# EAGLE schematic MSV-back (EAGLE 9.5.2)

## Sheet 1 of 5
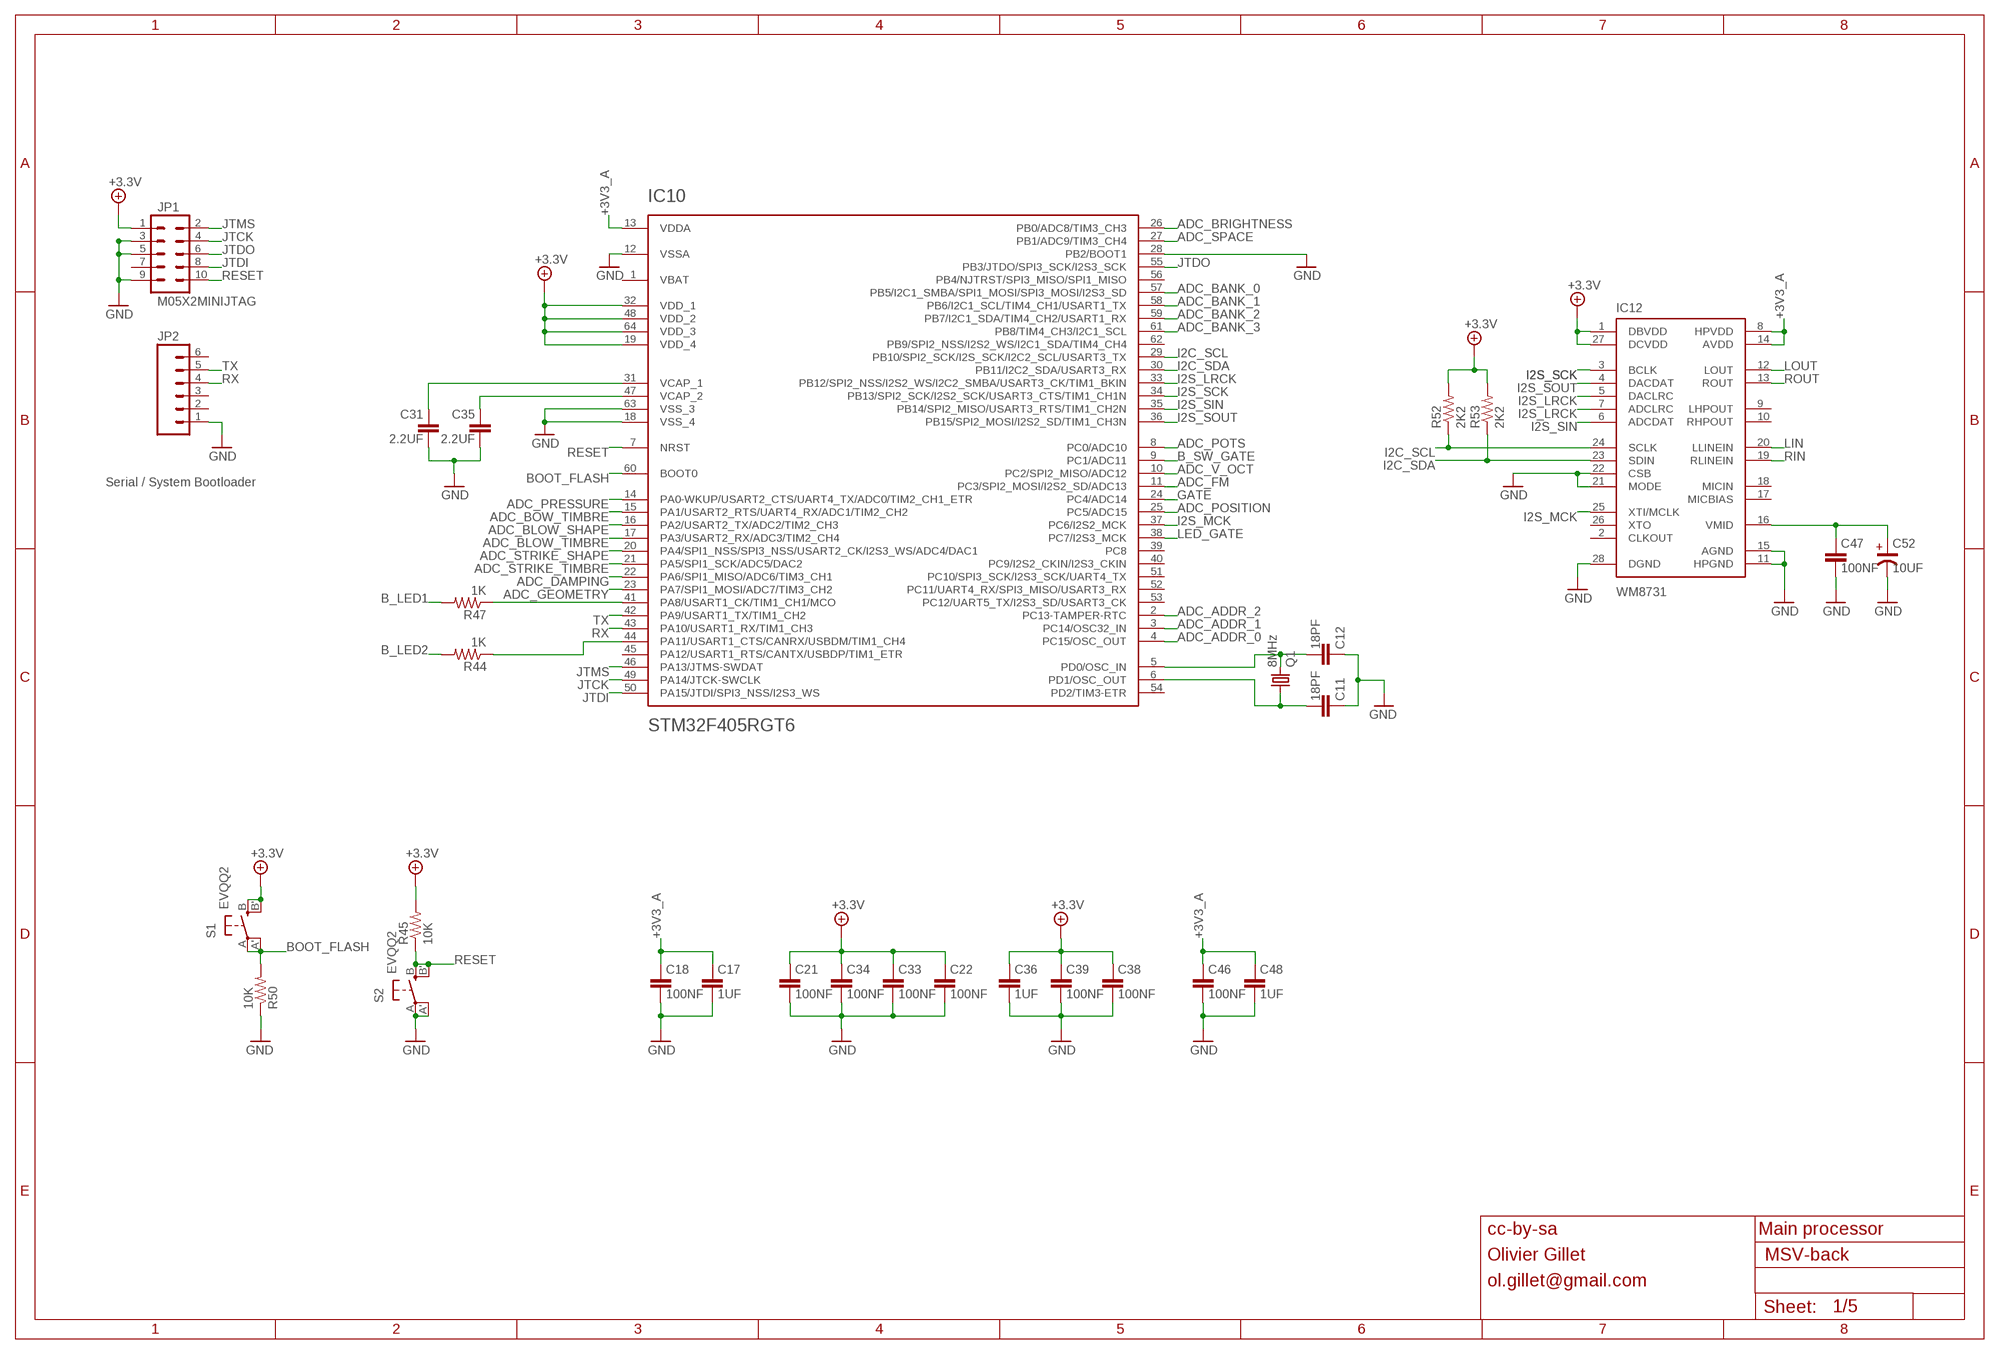
[diagram p0: schematic, sheet 1]

### Parts
C11  18PF  C-EUC0603  [C0603]
C12  18PF  C-EUC0603  [C0603]
C17  1UF  C-EUC0603  [C0603]
C18  100NF  C-EUC0603  [C0603]
C21  100NF  C-EUC0603  [C0603]
C22  100NF  C-EUC0603  [C0603]
C31  2.2UF  C-EUC0603  [C0603]
C33  100NF  C-EUC0603  [C0603]
C34  100NF  C-EUC0603  [C0603]
C35  2.2UF  C-EUC0603  [C0603]
C36  1UF  C-EUC0603  [C0603]
C38  100NF  C-EUC0603  [C0603]
C39  100NF  C-EUC0603  [C0603]
C46  100NF  C-EUC0603  [C0603]
C47  100NF  C-EUC0603  [C0603]
C48  1UF  C-EUC0603  [C0603]
C52  10UF  C-EU-POL_B  [PANASONIC_B]
IC10  STM32F405RGT6  STM32F20X  [TQFP-10X10-64]
IC12  WM8731  [SSOP-28]
JP1  M05X2MINIJTAG  [2X5-1.27]
JP2  M06_SQUARE  [1X06_SQUARE]
Q1  8MHz  CRYSTALHC49UP  [HC49UP]
R44  1K  R-US_R0603  [R0603]
R45  10K  R-US_R0603  [R0603]
R47  1K  R-US_R0603  [R0603]
R50  10K  R-US_R0603  [R0603]
R52  2K2  R-US_R0603  [R0603]
R53  2K2  R-US_R0603  [R0603]
S1  EVQQ2  [EVQ-Q2]
S2  EVQQ2  [EVQ-Q2]

### Nets
+3V3_A: C17.1 C18.1 C46.1 C48.1 IC10.13(VDDA) IC12.8(HPVDD) IC12.14(AVDD) ; also sheet 3,4,5
+3V3_D: C21.1 C22.1 C33.1 C34.1 C36.1 C38.1 C39.1 IC10.19(VDD_4) IC10.32(VDD_1) IC10.48(VDD_2) IC10.64(VDD_3) IC12.1(DBVDD) IC12.27(DCVDD) JP1.1 R45.2 R52.2 R53.2 S1.B'(S1) S1.B(S) ; supply symbol labelled +3.3V ; also sheet 5
ADC_ADDR_0: IC10.4(PC15/OSC_OUT) ; also sheet 4
ADC_ADDR_1: IC10.3(PC14/OSC32_IN) ; also sheet 4
ADC_ADDR_2: IC10.2(PC13-TAMPER-RTC) ; also sheet 4
ADC_BANK_0: IC10.57(PB5/I2C1_SMBA/SPI1_MOSI/SPI3_MOSI/I2S3_SD) ; also sheet 4
ADC_BANK_1: IC10.58(PB6/I2C1_SCL/TIM4_CH1/USART1_TX) ; also sheet 4
ADC_BANK_2: IC10.59(PB7/I2C1_SDA/TIM4_CH2/USART1_RX) ; also sheet 4
ADC_BANK_3: IC10.61(PB8/TIM4_CH3/I2C1_SCL) ; also sheet 4
ADC_BLOW_SHAPE: IC10.16(PA2/USART2_TX/ADC2/TIM2_CH3) ; also sheet 3
ADC_BLOW_TIMBRE: IC10.17(PA3/USART2_RX/ADC3/TIM2_CH4) ; also sheet 3
ADC_BOW_TIMBRE: IC10.15(PA1/USART2_RTS/UART4_RX/ADC1/TIM2_CH2) ; also sheet 3
ADC_BRIGHTNESS: IC10.26(PB0/ADC8/TIM3_CH3) ; also sheet 3
ADC_DAMPING: IC10.22(PA6/SPI1_MISO/ADC6/TIM3_CH1) ; also sheet 3
ADC_FM: IC10.11(PC3/SPI2_MOSI/I2S2_SD/ADC13) ; also sheet 3
ADC_GEOMETRY: IC10.23(PA7/SPI1_MOSI/ADC7/TIM3_CH2) ; also sheet 3
ADC_POSITION: IC10.25(PC5/ADC15) ; also sheet 3
ADC_POTS: IC10.8(PC0/ADC10) ; also sheet 4
ADC_PRESSURE: IC10.14(PA0-WKUP/USART2_CTS/UART4_TX/ADC0/TIM2_CH1_ETR) ; also sheet 3
ADC_SPACE: IC10.27(PB1/ADC9/TIM3_CH4) ; also sheet 3
ADC_STRIKE_SHAPE: IC10.20(PA4/SPI1_NSS/SPI3_NSS/USART2_CK/I2S3_WS/ADC4/DAC1) ; also sheet 3
ADC_STRIKE_TIMBRE: IC10.21(PA5/SPI1_SCK/ADC5/DAC2) ; also sheet 3
ADC_V_OCT: IC10.10(PC2/SPI2_MISO/ADC12) ; also sheet 3
B_LED1: R47.2 ; also sheet 4
B_LED2: R44.2 ; also sheet 4
B_SW_GATE: IC10.9(PC1/ADC11) ; also sheet 4
BOOT_FLASH: IC10.60(BOOT0) R50.2 S1.A'(P1) S1.A(P)
GATE: IC10.24(PC4/ADC14) ; also sheet 4
GND: C11.1 C12.1 C17.2 C18.2 C21.2 C22.2 C31.2 C33.2 C34.2 C35.2 C36.2 C38.2 C39.2 C46.2 C47.2 C48.2 C52.-(NEG) IC10.12(VSSA) IC10.18(VSS_4) IC10.28(PB2/BOOT1) IC10.63(VSS_3) IC12.11(HPGND) IC12.15(AGND) IC12.21(MODE) IC12.22(CSB) IC12.28(DGND) JP1.3 JP1.5 JP1.9 JP2.1 R50.1 S2.A'(P1) S2.A(P) ; also sheet 2,3,4,5
I2C_SCL: IC10.29(PB10/SPI2_SCK/I2S_SCK/I2C2_SCL/USART3_TX) IC12.24(SCLK) R52.1
I2C_SDA: IC10.30(PB11/I2C2_SDA/USART3_RX) IC12.23(SDIN) R53.1
I2S_LRCK: IC10.33(PB12/SPI2_NSS/I2S2_WS/I2C2_SMBA/USART3_CK/TIM1_BKIN) IC12.5(DACLRC) IC12.7(ADCLRC)
I2S_MCK: IC10.37(PC6/I2S2_MCK) IC12.25(XTI/MCLK)
I2S_SCK: IC10.34(PB13/SPI2_SCK/I2S2_SCK/USART3_CTS/TIM1_CH1N) IC12.3(BCLK)
I2S_SIN: IC10.35(PB14/SPI2_MISO/USART3_RTS/TIM1_CH2N) IC12.6(ADCDAT)
I2S_SOUT: IC10.36(PB15/SPI2_MOSI/I2S2_SD/TIM1_CH3N) IC12.4(DACDAT)
JTCK: IC10.49(PA14/JTCK-SWCLK) JP1.4
JTDI: IC10.50(PA15/JTDI/SPI3_NSS/I2S3_WS) JP1.8
JTDO: IC10.55(PB3/JTDO/SPI3_SCK/I2S3_SCK) JP1.6
JTMS: IC10.46(PA13/JTMS-SWDAT) JP1.2
LED_GATE: IC10.38(PC7/I2S3_MCK) ; also sheet 4
LIN: IC12.20(LLINEIN) ; also sheet 2
LOUT: IC12.12(LOUT) ; also sheet 2
N$7: C12.2 IC10.5(PD0/OSC_IN) Q1.2
N$8: C11.2 IC10.6(PD1/OSC_OUT) Q1.1
N$13: C35.1 IC10.47(VCAP_2)
N$17: C47.1 C52.+(POS) IC12.16(VMID)
N$19: C31.1 IC10.31(VCAP_1)
N$54: IC10.44(PA11/USART1_CTS/CANRX/USBDM/TIM1_CH4) R44.1
N$79: IC10.41(PA8/USART1_CK/TIM1_CH1/MCO) R47.1
RESET: IC10.7(NRST) JP1.10 R45.1 S2.B'(S1) S2.B(S)
RIN: IC12.19(RLINEIN) ; also sheet 2
ROUT: IC12.13(ROUT) ; also sheet 2
RX: IC10.43(PA10/USART1_RX/TIM1_CH3) JP2.4
TX: IC10.42(PA9/USART1_TX/TIM1_CH2) JP2.5
Unconnected: IC10.39(PC8) IC10.40(PC9/I2S2_CKIN/I2S3_CKIN) IC10.45(PA12/USART1_RTS/CANTX/USBDP/TIM1_ETR) IC10.51(PC10/SPI3_SCK/I2S3_SCK/UART4_TX) IC10.52(PC11/UART4_RX/SPI3_MISO/USART3_RX) IC10.53(PC12/UART5_TX/I2S3_SD/USART3_CK) IC10.54(PD2/TIM3-ETR) IC10.56(PB4/NJTRST/SPI3_MISO/SPI1_MISO) IC10.62(PB9/SPI2_NSS/I2S2_WS/I2C1_SDA/TIM4_CH4) IC12.2(CLKOUT) IC12.9(LHPOUT) IC12.10(RHPOUT) IC12.17(MICBIAS) IC12.18(MICIN) IC12.26(XTO) JP1.7 JP2.2 JP2.3 JP2.6

### Notes on the sheet
- Serial / System Bootloader
- cc-by-sa | Main processor
- Olivier Gillet
- ol.gillet@gmail.com

## Sheet 2 of 5
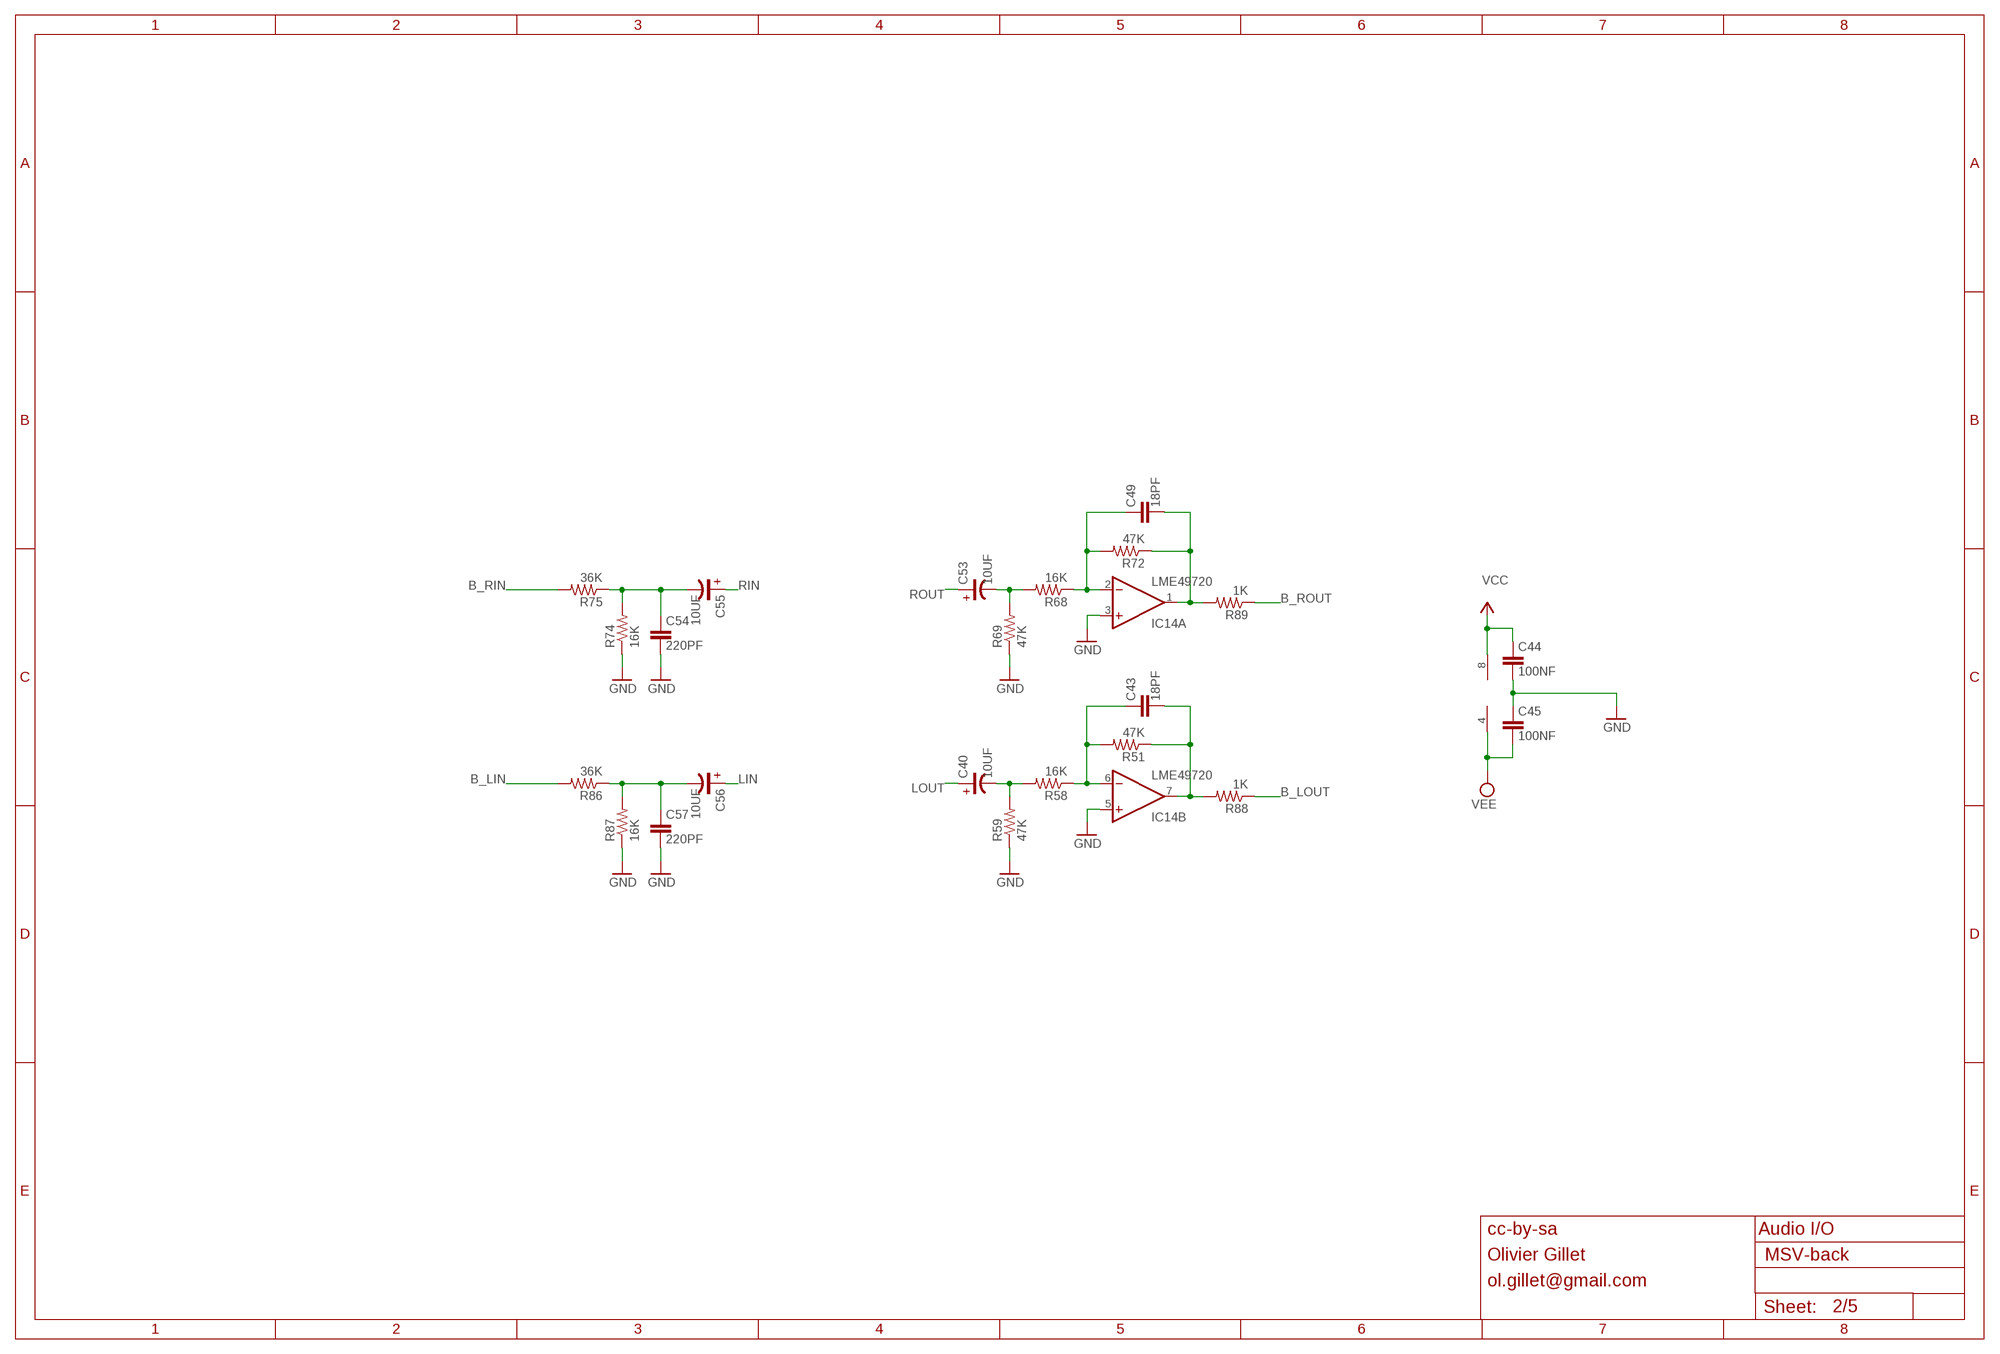
[diagram p1: schematic, sheet 2]

### Parts
C40  10UF  C-EU-POL_B  [PANASONIC_B]
C43  18PF  C-EUC0603  [C0603]
C44  100NF  C-EUC0603  [C0603]
C45  100NF  C-EUC0603  [C0603]
C49  18PF  C-EUC0603  [C0603]
C53  10UF  C-EU-POL_B  [PANASONIC_B]
C54  220PF  C-EUC0603  [C0603]
C55  10UF  C-EU-POL_B  [PANASONIC_B]
C56  10UF  C-EU-POL_B  [PANASONIC_B]
C57  220PF  C-EUC0603  [C0603]
IC14  LME49720  TL072_TSSOP-8  [TSSOP-8]
R51  47K  R-US_R0603  [R0603]
R58  16K  R-US_R0603  [R0603]
R59  47K  R-US_R0603  [R0603]
R68  16K  R-US_R0603  [R0603]
R69  47K  R-US_R0603  [R0603]
R72  47K  R-US_R0603  [R0603]
R74  16K  R-US_R0603  [R0603]
R75  36K  R-US_R0603  [R0603]
R86  36K  R-US_R0603  [R0603]
R87  16K  R-US_R0603  [R0603]
R88  1K  R-US_R0603  [R0603]
R89  1K  R-US_R0603  [R0603]

### Nets
B_LIN: R86.2 ; also sheet 4
B_LOUT: R88.1 ; also sheet 4
B_RIN: R75.2 ; also sheet 4
B_ROUT: R89.1 ; also sheet 4
GND: C44.2 C45.1 C54.2 C57.2 IC14.3(A:+IN) IC14.5(B:+IN) R59.1 R69.1 R74.1 R87.1 ; also sheet 1,3,4,5
LIN: C56.+(POS) ; also sheet 1
LOUT: C40.+(POS) ; also sheet 1
N$18: C56.-(NEG) C57.1 R86.1 R87.2
N$22: C54.1 C55.-(NEG) R74.2 R75.1
N$23: C40.-(NEG) R58.2 R59.2
N$25: C43.1 IC14.6(B:-IN) R51.2 R58.1
N$28: C43.2 IC14.7(B:OUT) R51.1 R88.2
N$31: C53.-(NEG) R68.2 R69.2
N$32: C49.1 IC14.2(A:-IN) R68.1 R72.2
N$33: C49.2 IC14.1(A:OUT) R72.1 R89.2
RIN: C55.+(POS) ; also sheet 1
ROUT: C53.+(POS) ; also sheet 1
VCC: C44.1 IC14.8(P:V+) ; also sheet 5
VEE: C45.2 IC14.4(P:V-) ; also sheet 5

### Notes on the sheet
- cc-by-sa | Audio I/O
- Olivier Gillet
- ol.gillet@gmail.com

## Sheet 3 of 5
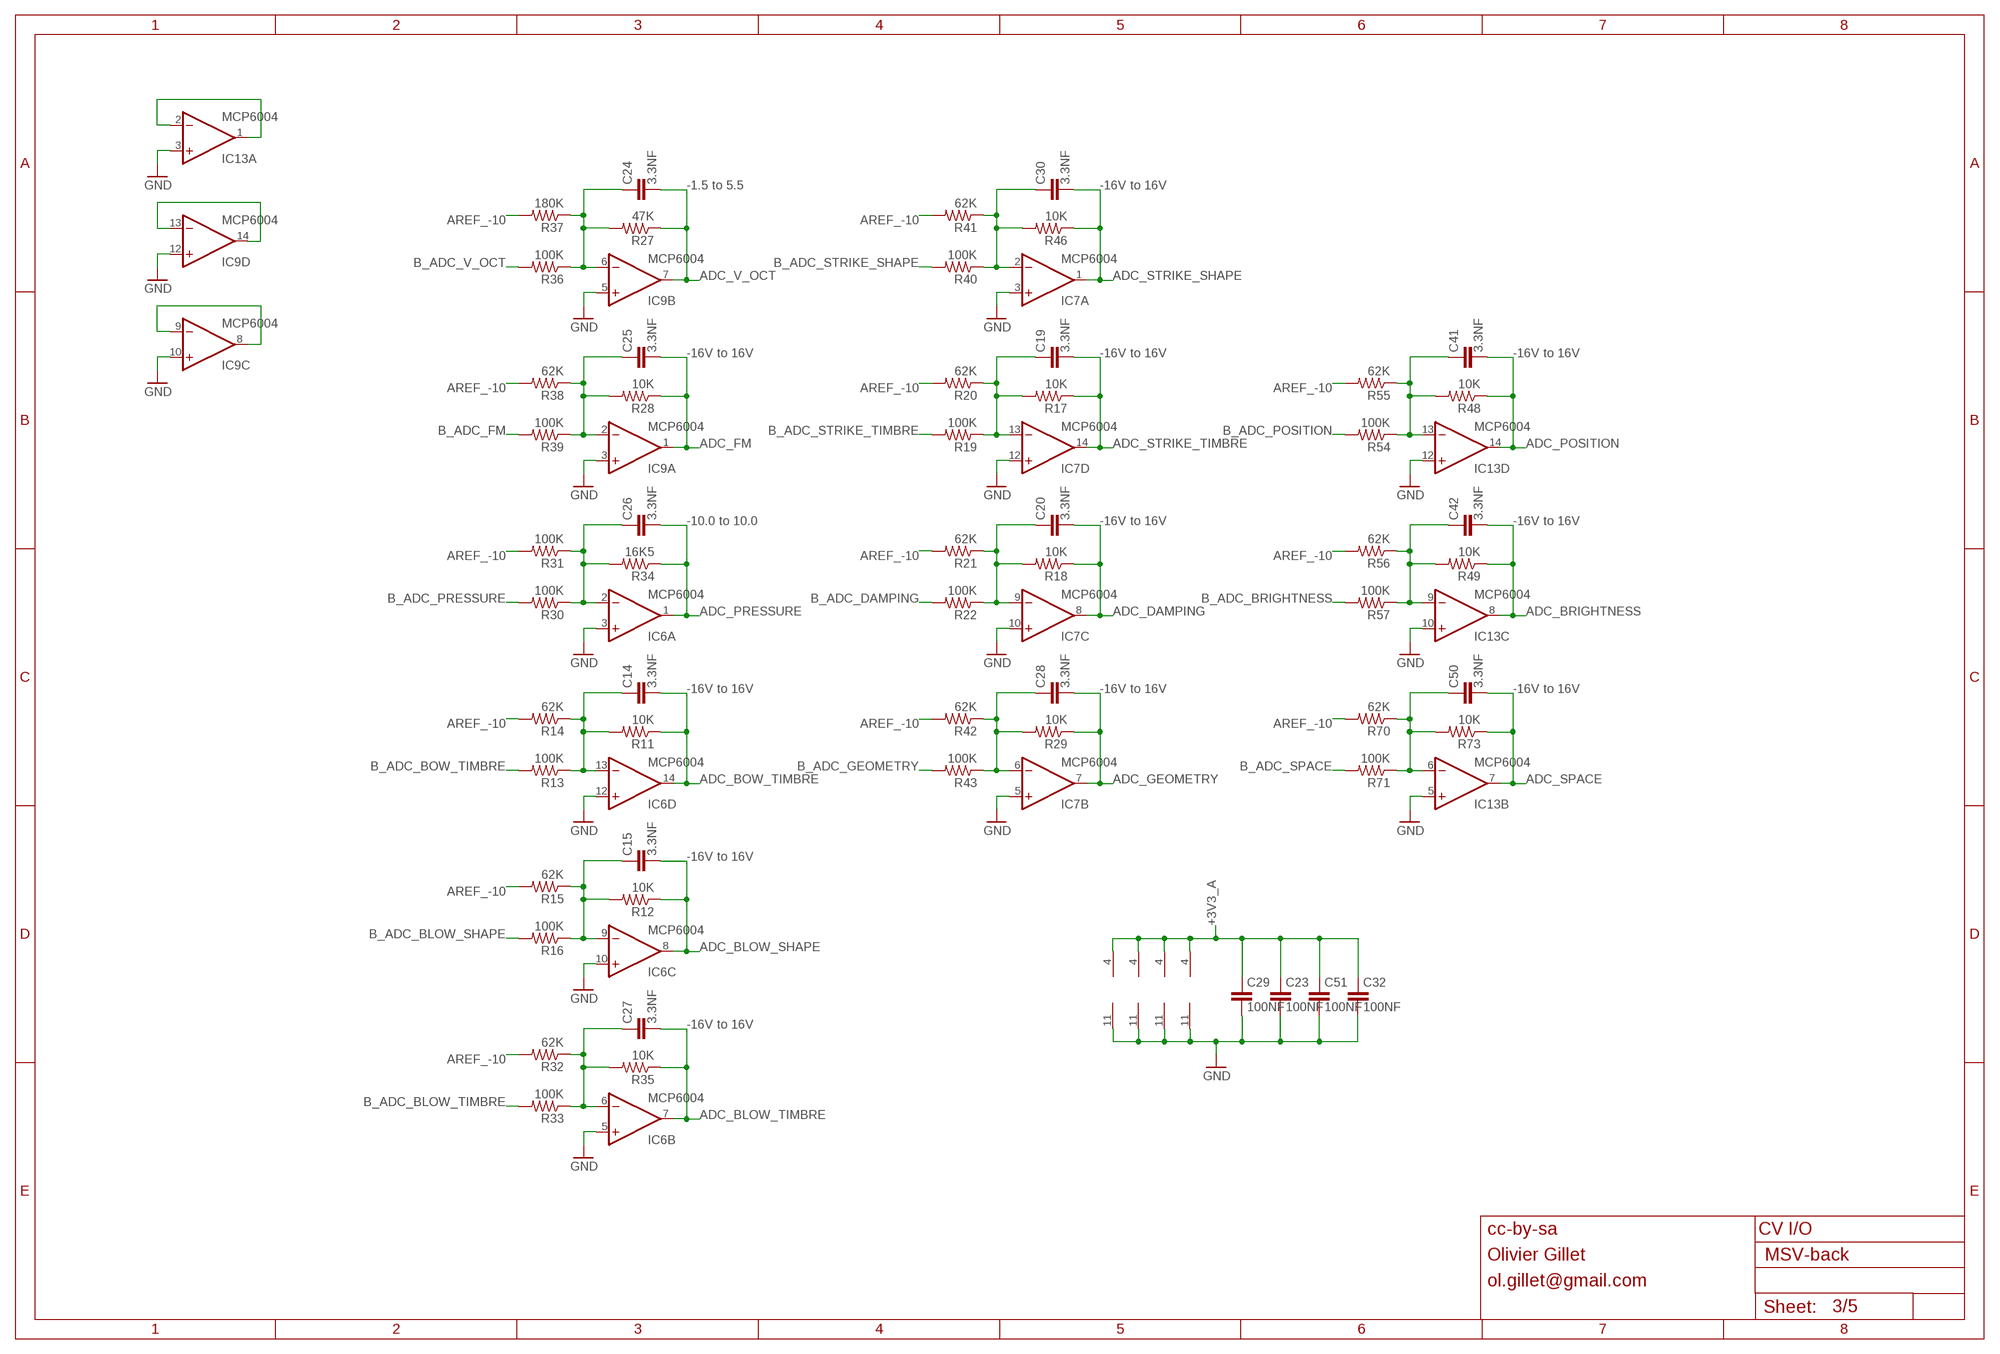
[diagram p2: schematic, sheet 3]

### Parts
C14  3.3NF  C-EUC0603  [C0603]
C15  3.3NF  C-EUC0603  [C0603]
C19  3.3NF  C-EUC0603  [C0603]
C20  3.3NF  C-EUC0603  [C0603]
C23  100NF  C-EUC0603  [C0603]
C24  3.3NF  C-EUC0603  [C0603]
C25  3.3NF  C-EUC0603  [C0603]
C26  3.3NF  C-EUC0603  [C0603]
C27  3.3NF  C-EUC0603  [C0603]
C28  3.3NF  C-EUC0603  [C0603]
C29  100NF  C-EUC0603  [C0603]
C30  3.3NF  C-EUC0603  [C0603]
C32  100NF  C-EUC0603  [C0603]
C41  3.3NF  C-EUC0603  [C0603]
C42  3.3NF  C-EUC0603  [C0603]
C50  3.3NF  C-EUC0603  [C0603]
C51  100NF  C-EUC0603  [C0603]
IC6  MCP6004  MCP6004_TSSOP-14  [TSSOP-14]
IC7  MCP6004  MCP6004_TSSOP-14  [TSSOP-14]
IC9  MCP6004  MCP6004_TSSOP-14  [TSSOP-14]
IC13  MCP6004  MCP6004_TSSOP-14  [TSSOP-14]
R11  10K  R-US_R0603  [R0603]
R12  10K  R-US_R0603  [R0603]
R13  100K  R-US_R0603  [R0603]
R14  62K  R-US_R0603  [R0603]
R15  62K  R-US_R0603  [R0603]
R16  100K  R-US_R0603  [R0603]
R17  10K  R-US_R0603  [R0603]
R18  10K  R-US_R0603  [R0603]
R19  100K  R-US_R0603  [R0603]
R20  62K  R-US_R0603  [R0603]
R21  62K  R-US_R0603  [R0603]
R22  100K  R-US_R0603  [R0603]
R27  47K  R-US_R0603  [R0603]
R28  10K  R-US_R0603  [R0603]
R29  10K  R-US_R0603  [R0603]
R30  100K  R-US_R0603  [R0603]
R31  100K  R-US_R0603  [R0603]
R32  62K  R-US_R0603  [R0603]
R33  100K  R-US_R0603  [R0603]
R34  16K5  R-US_R0603  [R0603]
R35  10K  R-US_R0603  [R0603]
R36  100K  R-US_R0603  [R0603]
R37  180K  R-US_R0603  [R0603]
R38  62K  R-US_R0603  [R0603]
R39  100K  R-US_R0603  [R0603]
R40  100K  R-US_R0603  [R0603]
R41  62K  R-US_R0603  [R0603]
R42  62K  R-US_R0603  [R0603]
R43  100K  R-US_R0603  [R0603]
R46  10K  R-US_R0603  [R0603]
R48  10K  R-US_R0603  [R0603]
R49  10K  R-US_R0603  [R0603]
R54  100K  R-US_R0603  [R0603]
R55  62K  R-US_R0603  [R0603]
R56  62K  R-US_R0603  [R0603]
R57  100K  R-US_R0603  [R0603]
R70  62K  R-US_R0603  [R0603]
R71  100K  R-US_R0603  [R0603]
R73  10K  R-US_R0603  [R0603]

### Nets
+3V3_A: C23.1 C29.1 C32.1 C51.1 IC6.4(P:V+) IC7.4(P:V+) IC9.4(P:V+) IC13.4(P:V+) ; also sheet 1,4,5
ADC_BLOW_SHAPE: C15.2 IC6.8(C:OUT) R12.1 ; also sheet 1
ADC_BLOW_TIMBRE: C27.2 IC6.7(B:OUT) R35.1 ; also sheet 1
ADC_BOW_TIMBRE: C14.2 IC6.14(D:OUT) R11.1 ; also sheet 1
ADC_BRIGHTNESS: C42.2 IC13.8(C:OUT) R49.1 ; also sheet 1
ADC_DAMPING: C20.2 IC7.8(C:OUT) R18.1 ; also sheet 1
ADC_FM: C25.2 IC9.1(A:OUT) R28.1 ; also sheet 1
ADC_GEOMETRY: C28.2 IC7.7(B:OUT) R29.1 ; also sheet 1
ADC_POSITION: C41.2 IC13.14(D:OUT) R48.1 ; also sheet 1
ADC_PRESSURE: C26.2 IC6.1(A:OUT) R34.1 ; also sheet 1
ADC_SPACE: C50.2 IC13.7(B:OUT) R73.1 ; also sheet 1
ADC_STRIKE_SHAPE: C30.2 IC7.1(A:OUT) R46.1 ; also sheet 1
ADC_STRIKE_TIMBRE: C19.2 IC7.14(D:OUT) R17.1 ; also sheet 1
ADC_V_OCT: C24.2 IC9.7(B:OUT) R27.1 ; also sheet 1
AREF_-10: R14.2 R15.2 R20.2 R21.2 R31.2 R32.2 R37.2 R38.2 R41.2 R42.2 R55.2 R56.2 R70.2 ; also sheet 5
B_ADC_BLOW_SHAPE: R16.2 ; also sheet 4
B_ADC_BLOW_TIMBRE: R33.2 ; also sheet 4
B_ADC_BOW_TIMBRE: R13.2 ; also sheet 4
B_ADC_BRIGHTNESS: R57.2 ; also sheet 4
B_ADC_DAMPING: R22.2 ; also sheet 4
B_ADC_FM: R39.2 ; also sheet 4
B_ADC_GEOMETRY: R43.2 ; also sheet 4
B_ADC_POSITION: R54.2 ; also sheet 4
B_ADC_PRESSURE: R30.2 ; also sheet 4
B_ADC_SPACE: R71.2 ; also sheet 4
B_ADC_STRIKE_SHAPE: R40.2 ; also sheet 4
B_ADC_STRIKE_TIMBRE: R19.2 ; also sheet 4
B_ADC_V_OCT: R36.2 ; also sheet 4
GND: C23.2 C29.2 C32.2 C51.2 IC6.3(A:+IN) IC6.5(B:+IN) IC6.10(C:+IN) IC6.11(P:V-) IC6.12(D:+IN) IC7.3(A:+IN) IC7.5(B:+IN) IC7.10(C:+IN) IC7.11(P:V-) IC7.12(D:+IN) IC9.3(A:+IN) IC9.5(B:+IN) IC9.10(C:+IN) IC9.11(P:V-) IC9.12(D:+IN) IC13.3(A:+IN) IC13.5(B:+IN) IC13.10(C:+IN) IC13.11(P:V-) IC13.12(D:+IN) ; also sheet 1,2,4,5
N$2: C15.1 IC6.9(C:-IN) R12.2 R15.1 R16.1
N$5: C14.1 IC6.13(D:-IN) R11.2 R13.1 R14.1
N$9: C19.1 IC7.13(D:-IN) R17.2 R19.1 R20.1
N$11: C24.1 IC9.6(B:-IN) R27.2 R36.1 R37.1
N$14: C20.1 IC7.9(C:-IN) R18.2 R21.1 R22.1
N$15: C25.1 IC9.2(A:-IN) R28.2 R38.1 R39.1
N$24: C30.1 IC7.2(A:-IN) R40.1 R41.1 R46.2
N$27: C27.1 IC6.6(B:-IN) R32.1 R33.1 R35.2
N$30: C42.1 IC13.9(C:-IN) R49.2 R56.1 R57.1
N$35: C50.1 IC13.6(B:-IN) R70.1 R71.1 R73.2
N$37: C28.1 IC7.6(B:-IN) R29.2 R42.1 R43.1
N$40: C41.1 IC13.13(D:-IN) R48.2 R54.1 R55.1
N$42: C26.1 IC6.2(A:-IN) R30.1 R31.1 R34.2
N$44: IC13.1(A:OUT) IC13.2(A:-IN)
N$56: IC9.13(D:-IN) IC9.14(D:OUT)
N$64: IC9.8(C:OUT) IC9.9(C:-IN)

### Notes on the sheet
- -1.5 to 5.5 | -16V to 16V
- -16V to 16V | -16V to 16V | -16V to 16V
- -10.0 to 10.0 | -16V to 16V | -16V to 16V
- -16V to 16V | -16V to 16V | -16V to 16V
- -16V to 16V
- -16V to 16V
- cc-by-sa | CV I/O
- Olivier Gillet
- ol.gillet@gmail.com

## Sheet 4 of 5
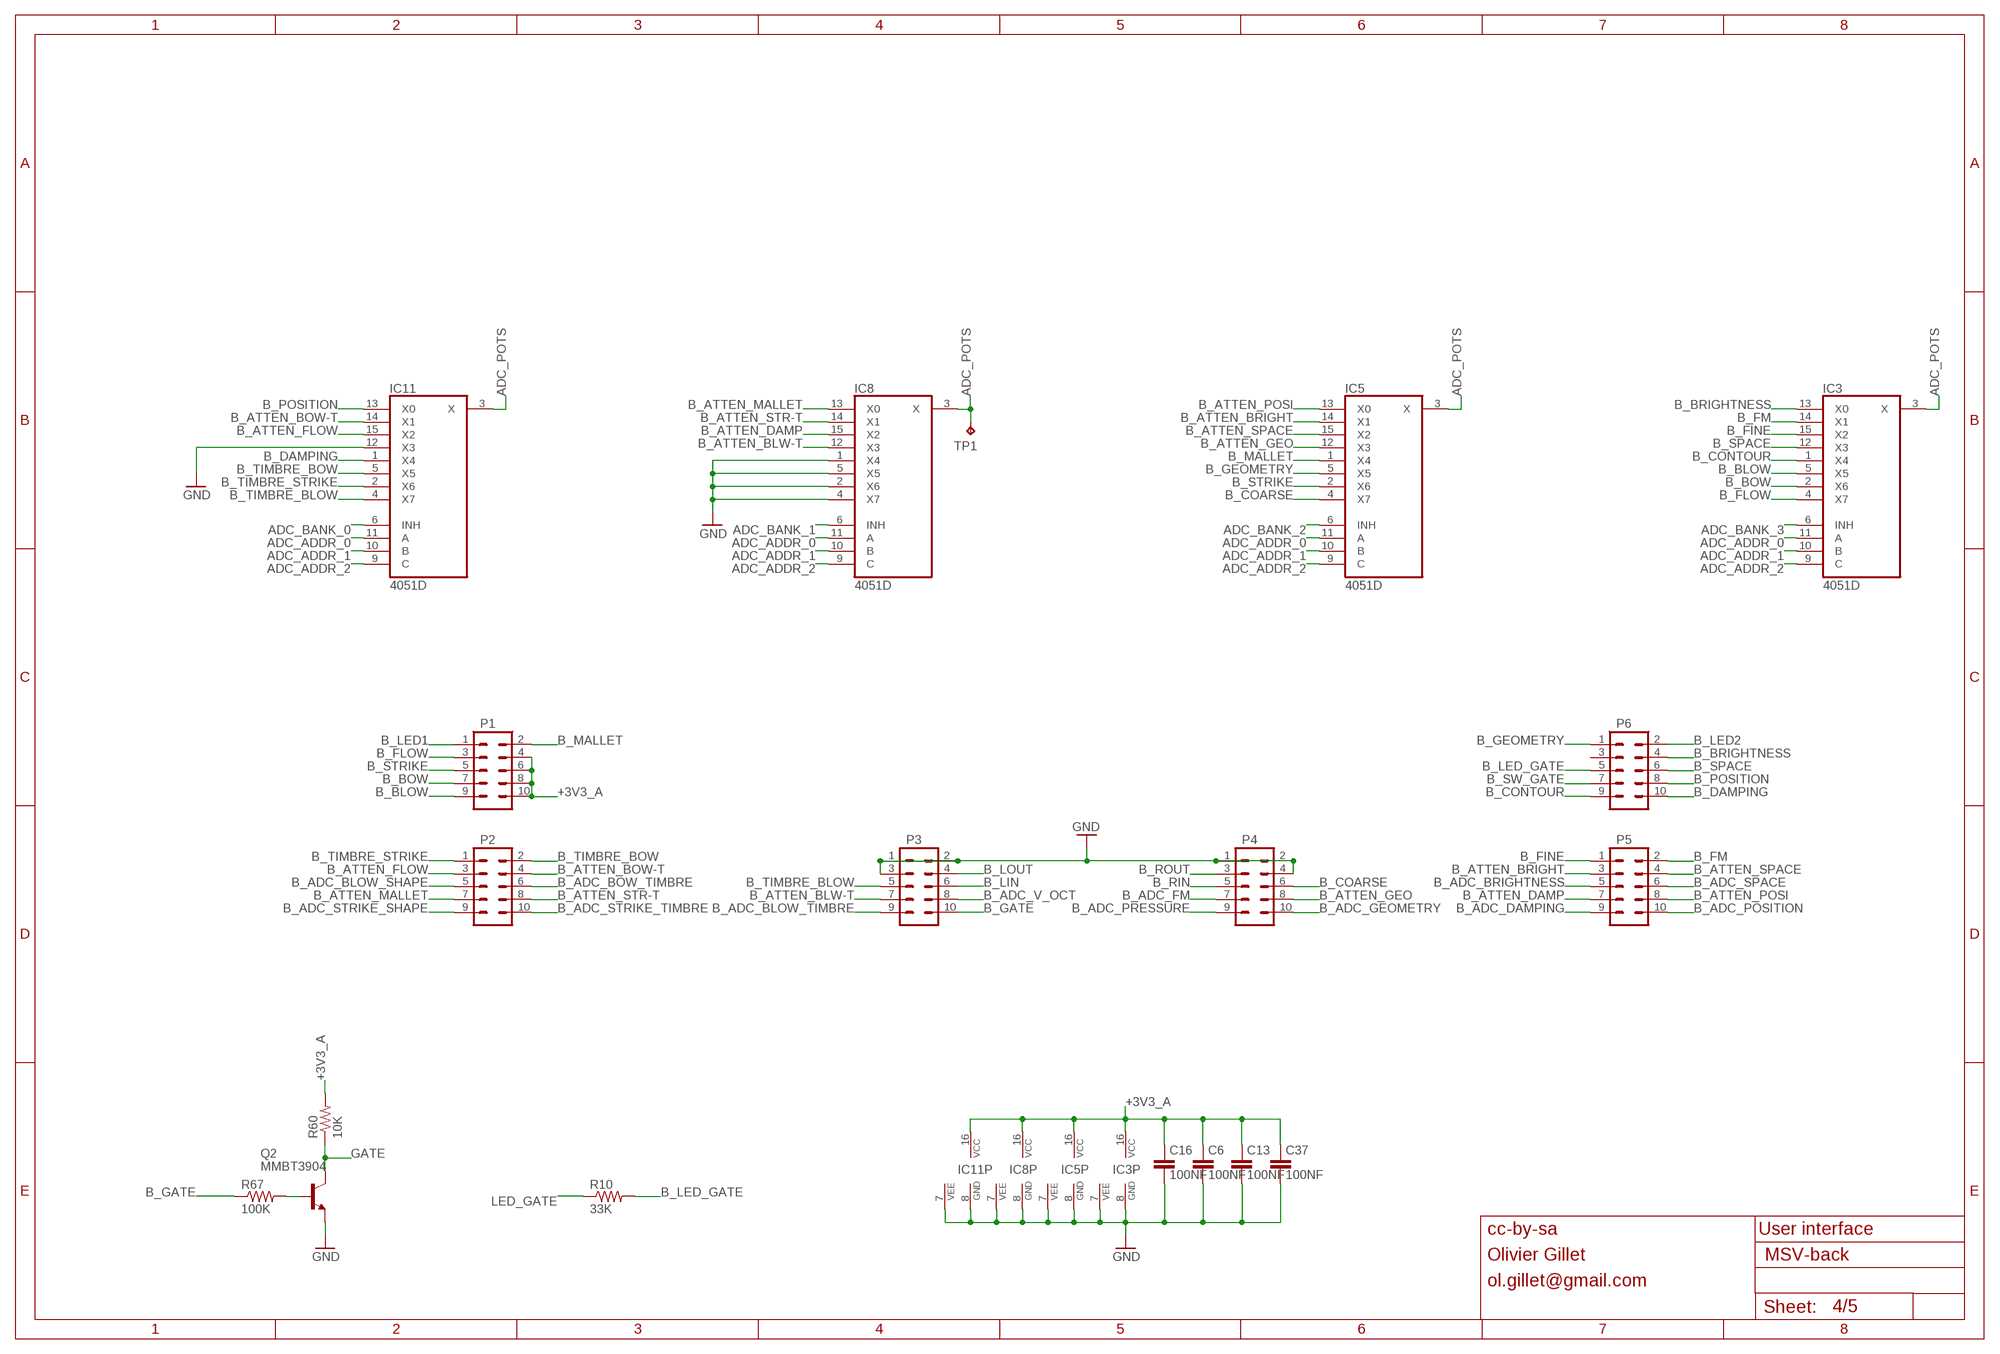
[diagram p3: schematic, sheet 4]

### Parts
C6  100NF  C-EUC0603  [C0603]
C13  100NF  C-EUC0603  [C0603]
C16  100NF  C-EUC0603  [C0603]
C37  100NF  C-EUC0603  [C0603]
IC3  4051D  [SO-16]
IC5  4051D  [SO-16]
IC8  4051D  [SO-16]
IC11  4051D  [SO-16]
P1  M05X2_LOCK_MALE  [2X5_LOCK_MALE]
P2  M05X2_LOCK_MALE  [2X5_LOCK_MALE]
P3  M05X2_LOCK_MALE  [2X5_LOCK_MALE]
P4  M05X2_LOCK_MALE  [2X5_LOCK_MALE]
P5  M05X2_LOCK_MALE  [2X5_LOCK_MALE]
P6  M05X2_LOCK_MALE  [2X5_LOCK_MALE]
Q2  MMBT3904  MMBT3904LT1-NPN-SOT23-BEC  [SOT23-BEC]
R10  33K  R-US_R0603  [R0603]
R60  10K  R-US_R0603  [R0603]
R67  100K  R-US_R0603  [R0603]
TP1  TPTP15R  [TP15R]

### Nets
+3V3_A: C6.1 C13.1 C16.1 C37.1 IC3.16(VCC) IC5.16(VCC) IC8.16(VCC) IC11.16(VCC) P1.4 P1.6 P1.8 P1.10 R60.2 ; also sheet 1,3,5
ADC_ADDR_0: IC3.11(A) IC5.11(A) IC8.11(A) IC11.11(A) ; also sheet 1
ADC_ADDR_1: IC3.10(B) IC5.10(B) IC8.10(B) IC11.10(B) ; also sheet 1
ADC_ADDR_2: IC3.9(C) IC5.9(C) IC8.9(C) IC11.9(C) ; also sheet 1
ADC_BANK_0: IC11.6(INH) ; also sheet 1
ADC_BANK_1: IC8.6(INH) ; also sheet 1
ADC_BANK_2: IC5.6(INH) ; also sheet 1
ADC_BANK_3: IC3.6(INH) ; also sheet 1
ADC_POTS: IC3.3(X) IC5.3(X) IC8.3(X) IC11.3(X) TP1.TP ; also sheet 1
B_ADC_BLOW_SHAPE: P2.5 ; also sheet 3
B_ADC_BLOW_TIMBRE: P3.9 ; also sheet 3
B_ADC_BOW_TIMBRE: P2.6 ; also sheet 3
B_ADC_BRIGHTNESS: P5.5 ; also sheet 3
B_ADC_DAMPING: P5.9 ; also sheet 3
B_ADC_FM: P4.7 ; also sheet 3
B_ADC_GEOMETRY: P4.10 ; also sheet 3
B_ADC_POSITION: P5.10 ; also sheet 3
B_ADC_PRESSURE: P4.9 ; also sheet 3
B_ADC_SPACE: P5.6 ; also sheet 3
B_ADC_STRIKE_SHAPE: P2.9 ; also sheet 3
B_ADC_STRIKE_TIMBRE: P2.10 ; also sheet 3
B_ADC_V_OCT: P3.8 ; also sheet 3
B_ATTEN_BLW-T: IC8.12(X3) P3.7
B_ATTEN_BOW-T: IC11.14(X1) P2.4
B_ATTEN_BRIGHT: IC5.14(X1) P5.3
B_ATTEN_DAMP: IC8.15(X2) P5.7
B_ATTEN_FLOW: IC11.15(X2) P2.3
B_ATTEN_GEO: IC5.12(X3) P4.8
B_ATTEN_MALLET: IC8.13(X0) P2.7
B_ATTEN_POSI: IC5.13(X0) P5.8
B_ATTEN_SPACE: IC5.15(X2) P5.4
B_ATTEN_STR-T: IC8.14(X1) P2.8
B_BLOW: IC3.5(X5) P1.9
B_BOW: IC3.2(X6) P1.7
B_BRIGHTNESS: IC3.13(X0) P6.4
B_COARSE: IC5.4(X7) P4.6
B_CONTOUR: IC3.1(X4) P6.9
B_DAMPING: IC11.1(X4) P6.10
B_FINE: IC3.15(X2) P5.1
B_FLOW: IC3.4(X7) P1.3
B_FM: IC3.14(X1) P5.2
B_GATE: P3.10 R67.1
B_GEOMETRY: IC5.5(X5) P6.1
B_LED1: P1.1 ; also sheet 1
B_LED2: P6.2 ; also sheet 1
B_LED_GATE: P6.5 R10.2
B_LIN: P3.6 ; also sheet 2
B_LOUT: P3.4 ; also sheet 2
B_MALLET: IC5.1(X4) P1.2
B_POSITION: IC11.13(X0) P6.8
B_RIN: P4.5 ; also sheet 2
B_ROUT: P4.3 ; also sheet 2
B_SPACE: IC3.12(X3) P6.6
B_STRIKE: IC5.2(X6) P1.5
B_SW_GATE: P6.7 ; also sheet 1
B_TIMBRE_BLOW: IC11.4(X7) P3.5
B_TIMBRE_BOW: IC11.5(X5) P2.2
B_TIMBRE_STRIKE: IC11.2(X6) P2.1
GATE: Q2.C R60.1 ; also sheet 1
GND: C6.2 C13.2 C16.2 C37.2 IC3.7(VEE) IC3.8(GND) IC5.7(VEE) IC5.8(GND) IC8.1(X4) IC8.2(X6) IC8.4(X7) IC8.5(X5) IC8.7(VEE) IC8.8(GND) IC11.7(VEE) IC11.8(GND) IC11.12(X3) P3.1 P3.2 P3.3 P4.1 P4.2 P4.4 Q2.E ; also sheet 1,2,3,5
LED_GATE: R10.1 ; also sheet 1
N$66: Q2.B R67.2
Unconnected: P6.3

### Notes on the sheet
- cc-by-sa | User interface
- Olivier Gillet
- ol.gillet@gmail.com

## Sheet 5 of 5
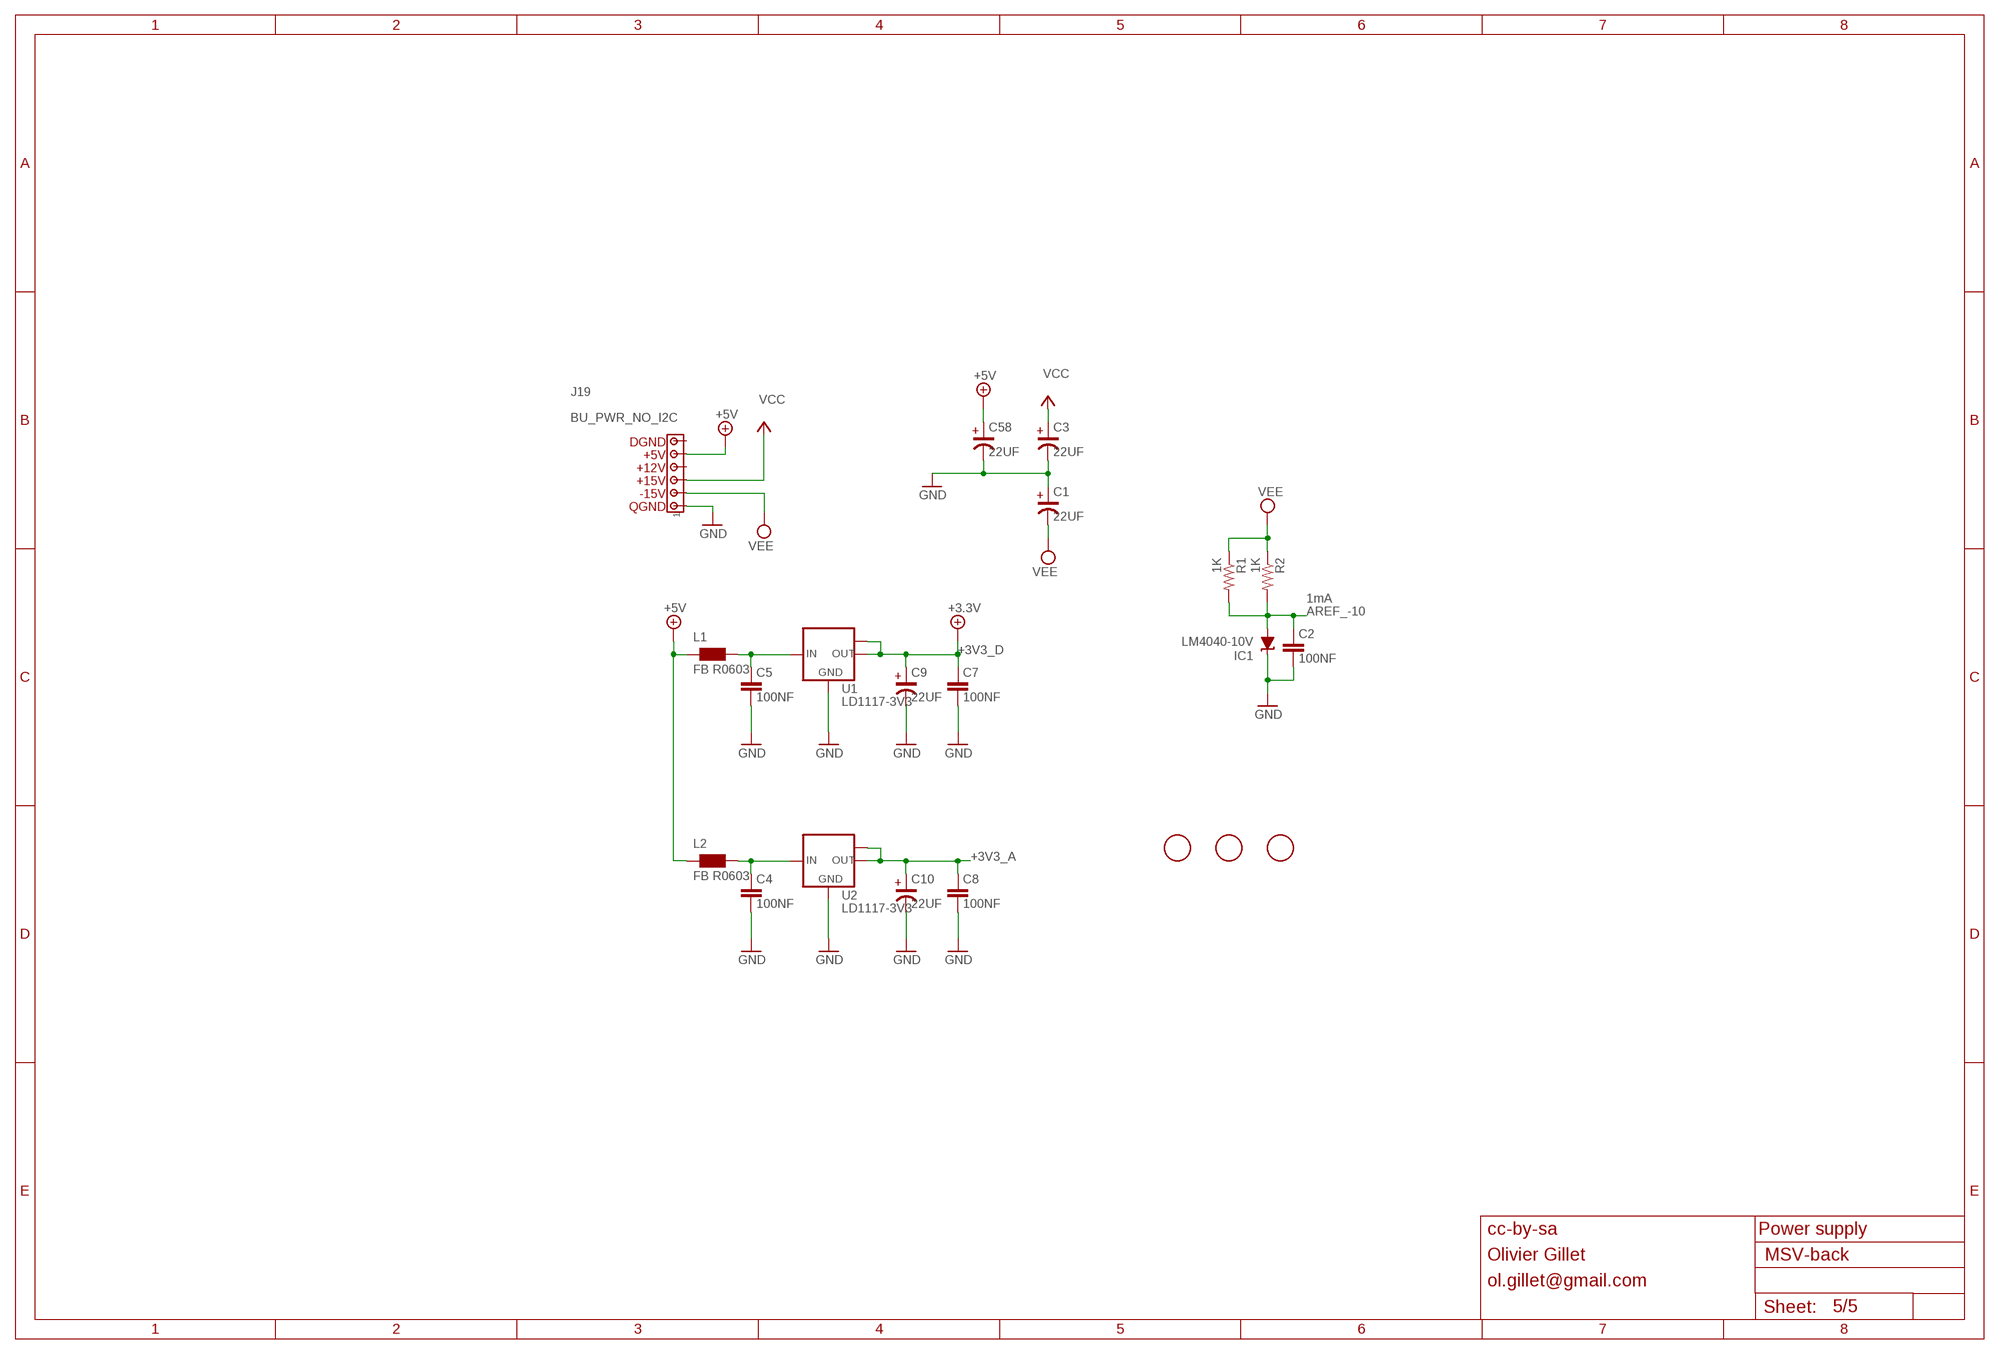
[diagram p4: schematic, sheet 5]

### Parts
C1  22UF  C-EU-POL_C  [PANASONIC_C]
C2  100NF  C-EUC0603  [C0603]
C3  22UF  C-EU-POL_C  [PANASONIC_C]
C4  100NF  C-EUC0603  [C0603]
C5  100NF  C-EUC0603  [C0603]
C7  100NF  C-EUC0603  [C0603]
C8  100NF  C-EUC0603  [C0603]
C9  22UF  C-EU-POL_C  [PANASONIC_C]
C10  22UF  C-EU-POL_C  [PANASONIC_C]
C58  22UF  C-EU-POL_C  [PANASONIC_C]
FD1  FIDUCIAL  [FIDUCIAL_1MM]
FD2  FIDUCIAL  [FIDUCIAL_1MM]
FD3  FIDUCIAL  [FIDUCIAL_1MM]
IC1  LM4040-10V  LM4040-10VA12DBZ  [DBZ_R-PDSO-G3]
J19  BU_PWR_NO_I2C  [MTA_156]
L1  FB R0603  FERRITE_BEAD_0603  [WUERTH-ELEKTRONIK_0603]
L2  FB R0603  FERRITE_BEAD_0603  [WUERTH-ELEKTRONIK_0603]
R1  1K  R-US_R0603  [R0603]
R2  1K  R-US_R0603  [R0603]
U1  LD1117-3V3  [SOT223]
U2  LD1117-3V3  [SOT223]

### Nets
+3V3_A: C8.1 C10.+(POS) U2.2(OUT) U2.TAB(OUT1) ; also sheet 1,3,4
+3V3_D: C7.1 C9.+(POS) U1.2(OUT) U1.TAB(OUT1) ; supply symbol labelled +3.3V ; also sheet 1
+5V: C58.+(POS) J19.5 L1.1 L2.1
AREF_-10: C2.1 IC1.2(A) R1.2 R2.2 ; also sheet 3
GND: C1.+(POS) C2.2 C3.-(NEG) C4.2 C5.2 C7.2 C8.2 C9.-(NEG) C10.-(NEG) C58.-(NEG) IC1.1(C) J19.1 U1.1(GND) U2.1(GND) ; also sheet 1,2,3,4
N$61: C5.1 L1.2 U1.3(IN)
N$80: C4.1 L2.2 U2.3(IN)
VCC: C3.+(POS) J19.3 ; also sheet 2
VEE: C1.-(NEG) J19.2 R1.1 R2.1 ; also sheet 2
Unconnected: J19.4 J19.6

### Notes on the sheet
- 1mA
- cc-by-sa | Power supply
- Olivier Gillet
- ol.gillet@gmail.com

## Power pins joined to a net without a drawn wire
VBAT: IC10.1(VBAT)

## Library data of the parts
C1 C3 C9 C10 C40 C52 C53 C55 C56 C58 = Electrosmith-Passives:C-EU-POL
C2 C4-C8 C11-C39 C41-C51 C54 C57 = Electrosmith-Passives:C-EU: CAPACITOR, European symbol; PACKAGE: C0603
FD1-FD3 = Electrosmith-Connectors:FIDUCIAL: For use by pick and place machines to calibrate the vision/machine, 1mm By microbuilder.eu
IC1 = Electrosmith-Power:LM4040-10V: PRECISION MICROPOWER SHUNT VOLTAGE REFERENCE Source: http://focus.ti.com/lit/ds/slcs146e/slcs146e.pdf; IPN: LM4040-10V; MPN: LM4041A12IDBZR; OC_FARNELL: 1407949; OC_NEWARK: 58K5875; PACKAGE: SOT-23
IC3 IC5 IC8 = Electrosmith-IC:4051: 8-channel ANALOG MULTIPLEXER
IC6 IC7 IC9 IC13 = Electrosmith-IC:MCP6004; BIN#: N/A; IPN: MCP6004 TSSOP-14; MPN: MCP6004T-E/ST; PACKAGE: TSSOP-14
IC10 = Electrosmith-IC:STM32F20X; IPN: empty; MPN: empty
IC11 = Electrosmith-IC:4051: 8-channel ANALOG MULTIPLEXER; SPICEPREFIX: X
IC12 = Electrosmith-IC:WM8731; BIN#: 16-001; IPN: WM8731; MPN: WM8731SEDS/RV; PACKAGE: SSOP-28
IC14 = Electrosmith-IC:TL072: OP AMP; BIN#: 12-004; IPN: TL072 TSSOP-8; MPN: TL072CPWR; PACKAGE: TSSOP-8
J19 = Electrosmith-Connectors:BU_PWR_NO_I2C; 12V: +12V; 5V: +5V; DGND: DGND; PIN1_LABEL: 1; QGND: QGND; VCC: +15V; VEE: -15V
JP1 = Electrosmith-Connectors:M05X2: Header 5x2 Standard 10-pin dual row 0.1" header. Commonly used with AVR-ISP. Use with Spark Fun Electronics SKU: PRT-00778; IPN: Mini JTAG Header; MPN: 20021111-00010T4LF
JP2 = Electrosmith-Connectors:M06: Header 6 Standard 6-pin 0.1" header. Use with straight break away headers (SKU : PRT-00116), right angle break away headers (PRT-00553), swiss pins (PRT-00743), machine pins (PRT-00117), and female headers (PRT-00115). Molex polarized connector foot print use with SKU : PRT-08094 with associated crimp pins and housings. NOTES ON THE VARIANTS LOCK and LOCK_LONGPADS... This footprint was designed to help hold the alignment of a through-hole component (i.e. 6-pin header) while soldering it into place. You may notice that each hole has been shifted either up or down by 0.005 of an inch from it's more standard position (which is a perfectly straight line). This slight alteration caused the pins (the squares in the middle) to touch the edges of the holes. Because they are alternating, it causes a "brace" to hold the component in place. 0.005 has proven to be the perfect amount of "off-center" position when using our standard breakaway headers. Although looks a little odd when you look at the bare footprint, once you have a header in there, the alteration is very hard to notice. Also, if you push a header all the way into place, it is covered up entirely on the bottom side. This idea of altering the position of holes to aid alignment will be further integrated into the Sparkfun Library for other footprints. It can help hold any component with 3 or more connection pins.
L1 L2 = Electrosmith-Passives:FERRITE_BEAD: SMD EMI Suppression Ferrite Beads - excellent anti-EMI properties - low DCR - impedances till 3000 ohms - rated current up to 6 A; BIN#: 8-047; IPN: FB R0603; MPN: MI0603J601R-10; PACKAGE: R0603
P1-P6 = Electrosmith-Connectors:M05X2: Header 5x2 Standard 10-pin dual row 0.1" header. Commonly used with AVR-ISP. Use with Spark Fun Electronics SKU: PRT-00778; LABEL: MALE
Q1 = Electrosmith-Passives:CRYSTAL: CRYSTAL; OC_FARNELL: unknown; OC_NEWARK: unknown
Q2 = Electrosmith-Semiconductors:*-NPN-: NPN Transistror BF959 corrected 2008.03.06
R1 R2 R10-R22 R27-R60 R67-R75 R86-R89 = Electrosmith-Passives:R-US_: RESISTOR, American symbol; PACKAGE: R0603
S1 S2 = Electrosmith-Interface:EVQQ2: SMT 6mm switch, EVQQ2 series http://www.ladyada.net/library/eagle
TP1 = Electrosmith-Connectors:TP: Test pad
U1 U2 = Electrosmith-Power:LD1117; BIN#: 12-024; IPN: LD1117-3V3; MPN: LD1117S33CTR; PACKAGE: SOT-223

## Net classes
0 default: width 0.203 mm